# Altium schematic sheet Strategy.schdoc
size 508 x 508 mm
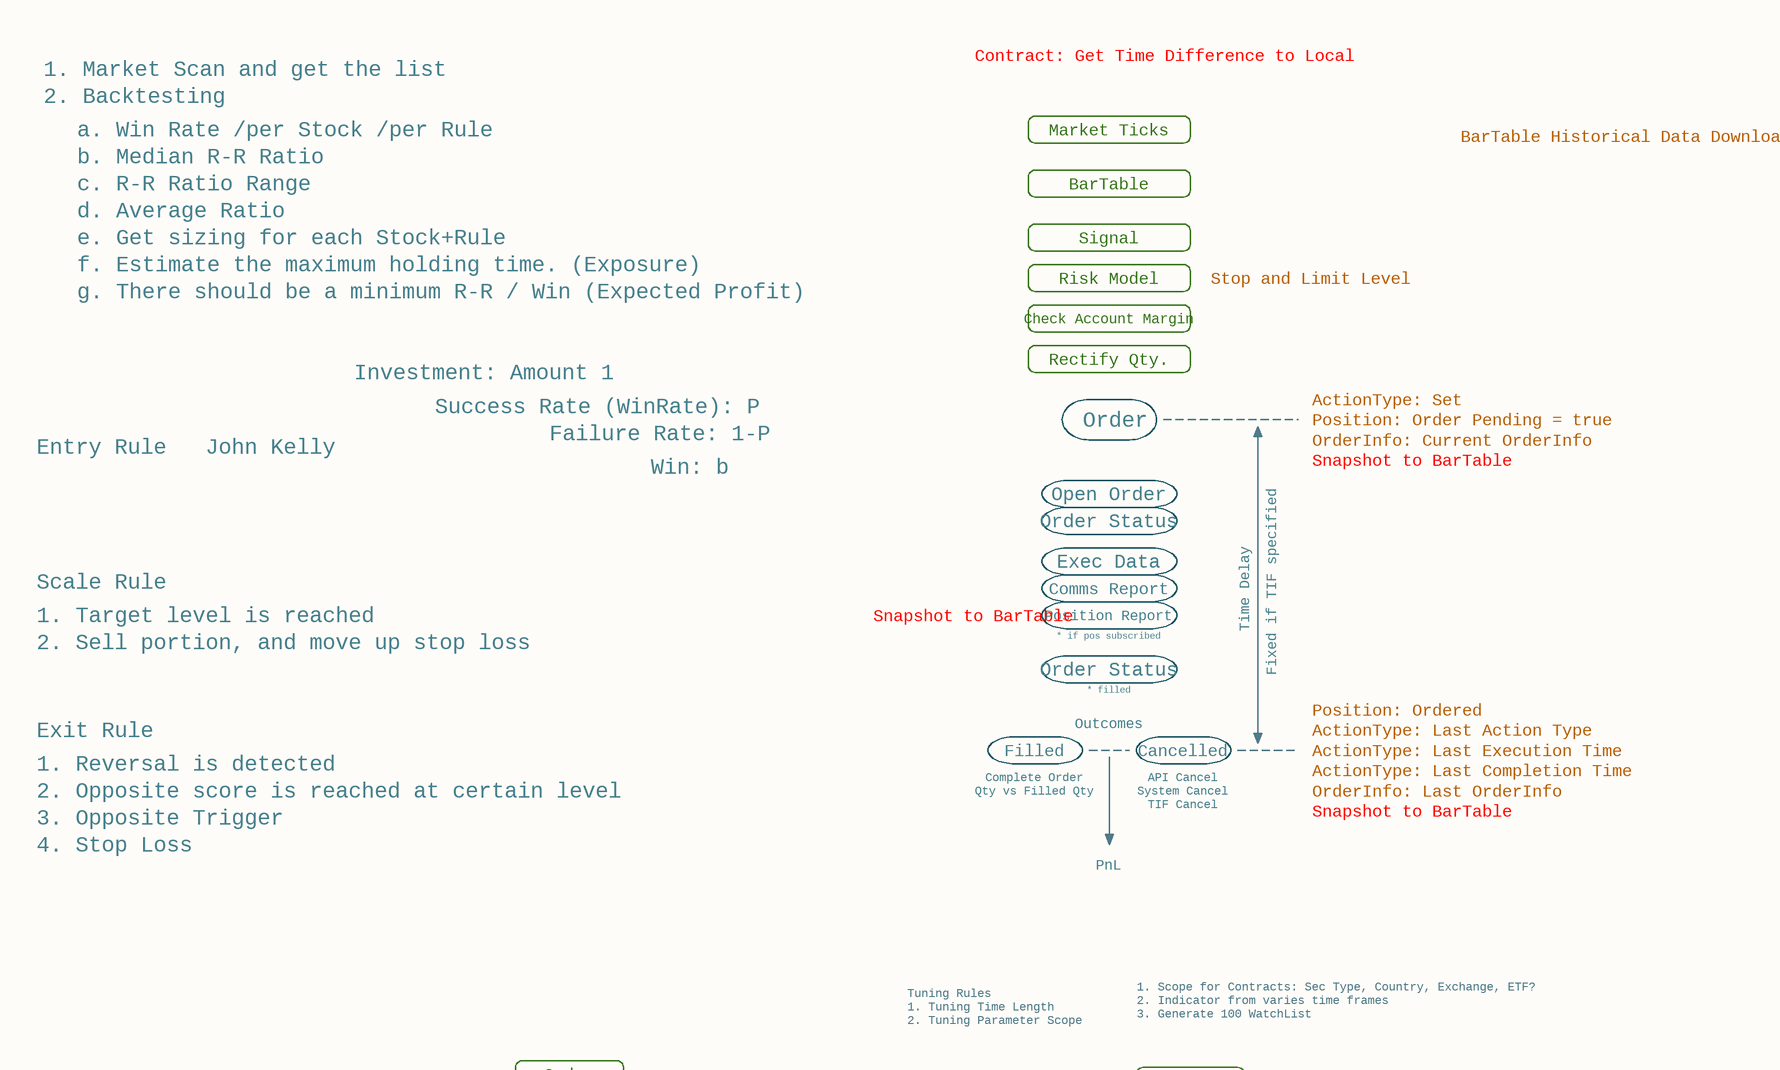
[diagram p0: Strategy.schdoc, top left]
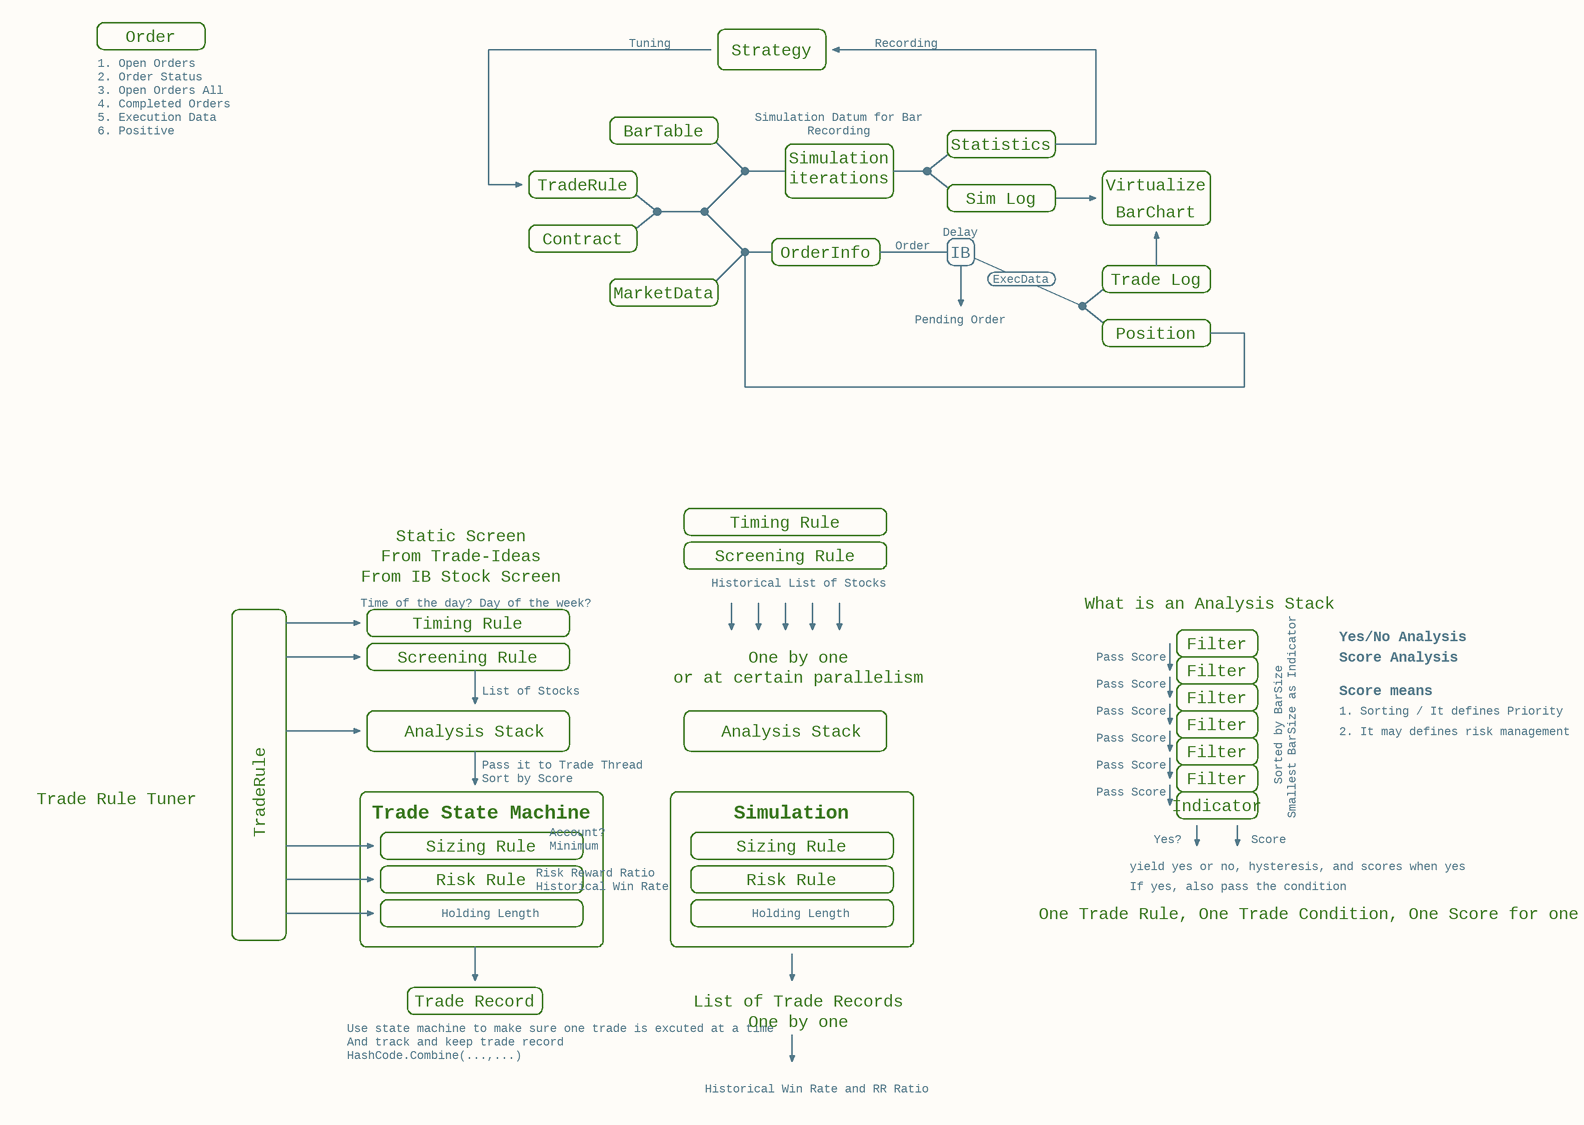
[diagram p1: Strategy.schdoc, bottom left]
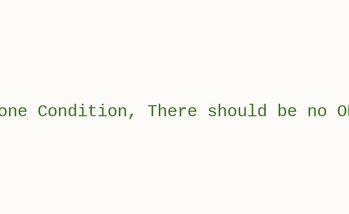
[diagram p2: Strategy.schdoc, bottom right]

## Notes on the sheet
- 1. Market Scan and get the list
- Contract: Get Time Difference to Local
- 2. Backtesting
- a. Win Rate /per Stock /per Rule
- b. Median R-R Ratio
- Market Ticks
- BarTable Historical Data Download
- c. R-R Ratio Range
- d. Average Ratio
- BarTable
- e. Get sizing for each Stock+Rule
- g. There should be a minimum R-R / Win (Expected Profit)
- f. Estimate the maximum holding time. (Exposure)
- Signal
- Risk Model
- Stop and Limit Level
- Check Account Margin
- Rectify Qty.
- Investment: Amount 1
- Success Rate (WinRate): P
- Failure Rate: 1-P
- Order
- Position: Order Pending = true
- ActionType: Set
- Entry Rule
- John Kelly
- Win: b
- Open Order
- OrderInfo: Current OrderInfo
- Snapshot to BarTable
- Order Status
- Exec Data
- Scale Rule
- 1. Target level is reached
- Comms Report
- Position Report
- Time Delay
- Fixed if TIF specified
- 2. Sell portion, and move up stop loss
- * if pos subscribed
- * filled
- Exit Rule
- 1. Reversal is detected
- Filled
- Outcomes
- Cancelled
- Position: Ordered
- ActionType: Last Action Type
- ActionType: Last Execution Time
- 2. Opposite score is reached at certain level
- 3. Opposite Trigger
- Complete Order
- Qty vs Filled Qty
- API Cancel
- System Cancel
- TIF Cancel
- ActionType: Last Completion Time
- OrderInfo: Last OrderInfo
- 4. Stop Loss
- PnL
- Tuning Rules
- 1. Tuning Time Length
- 2. Tuning Parameter Scope
- 2. Indicator from varies time frames
- 1. Scope for Contracts: Sec Type, Country, Exchange, ETF?
- 3. Generate 100 WatchList
- 1. Open Orders
- Tuning
- Strategy
- Recording
- 3. Open Orders All
- 4. Completed Orders
- 2. Order Status
- 5. Execution Data
- 6. Positive
- Simulation Datum for Bar
- TradeRule
- Simulation
- iterations
- Sim Log
- Statistics
- Virtualize
- Contract
- OrderInfo
- IB
- Delay
- BarChart
- MarketData
- Pending Order
- ExecData
- Trade Log
- Position
- Static Screen
- Timing Rule
- Time of the day? Day of the week?
- From Trade-Ideas
- From IB Stock Screen
- Historical List of Stocks
- Screening Rule
- What is an Analysis Stack
- One by one
- Pass Score
- Filter
- Score Analysis
- Yes/No Analysis
- Analysis Stack
- List of Stocks
- or at certain parallelism
- Score means
- 1. Sorting / It defines Priority
- 2. It may defines risk management
- Trade Rule Tuner
- Pass it to Trade Thread
- Sort by Score
- Indicator
- Sorted by BarSize
- Trade State Machine
- Sizing Rule
- Risk Rule
- Risk Reward Ratio
- Account?
- Minimum
- yield yes or no, hysteresis, and scores when yes
- Yes?
- Score
- Smallest BarSize as Indicator
- Holding Length
- Historical Win Rate
- If yes, also pass the condition
- One Trade Rule, One Trade Condition, One Score for one Condition, There should be no OR situation!!
- Trade Record
- List of Trade Records
- Use state machine to make sure one trade is excuted at a time
- And track and keep trade record
- HashCode.Combine(...,...)
- Historical Win Rate and RR Ratio